# EAGLE design piezo-preamp-tickler_V3-4_single-supply-OPA1642 (EAGLE 8.5.0)

## Sheet 1 of 2
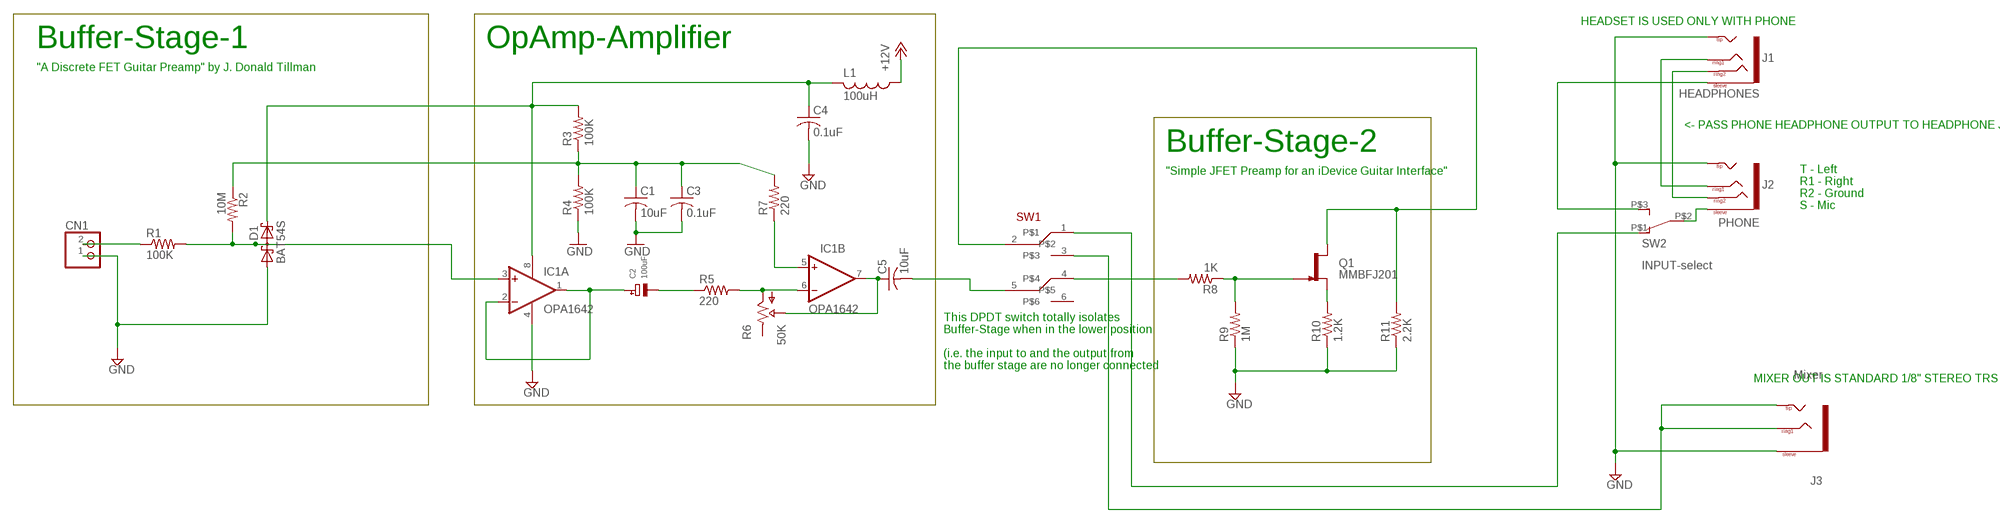
[diagram p0: schematic, sheet 1]

### Parts
C1  10uF  C-USC0805K  [C0805K]
C2  100uF  CAP_TANTALUMA/3216_REFLOW  [EIA3216-18/A-R]
C3  0.1uF  C-USC0805K  [C0805K]
C4  0.1uF  C-USC0805K  [C0805K]
C5  10uF  C-USC0805  [C0805]
CN1  JST_2PIN-THM  [JST-PH-2-THM]
D1  BAT54S  [SOT23]
IC1  OPA1642  OPA2134UA  [SO08]
J1  HEADPHONES  TRRS-1/8"-3.5MMLGPADS  [TRRS_SJ-43514-SMT-TR]
J2  PHONE  TRRS-1/8"-3.5MMLGPADS  [TRRS_SJ-43514-SMT-TR]
J3  Mixer  TRS-1/8"-3.5MM  [TRS_SJ-3524-SMT]
L1  100uH  L-USL3225P  [L3225P]
Q1  MMBFJ201  J201SOT-23  [SOT23-3]
R1  100K  R-US_R0603  [R0603]
R2  10M  R-US_R0603  [R0603]
R3  100K  R-US_R0603  [R0603]
R4  100K  R-US_R0603  [R0603]
R5  220  R-US_R0603  [R0603]
R6  50K  POTPOT-THUMB-ALPHA  [POT-THUMB-14MM_ALPHA-RV100F-30-4K1B-B10K-B301]
R7  220  R-US_R0603  [R0603]
R8  1K  R-US_R0603  [R0603]
R9  1M  R-US_R0603  [R0603]
R10  1.2K  R-US_R0603  [R0603]
R11  2.2K  R-US_R0603  [R0603]
SW1  SWITCH_DPDT  [SWITCH_DPDT_CL-SB-22B]
SW2  INPUT-select  SWITCH_SPDTCL-SB-12B  [SWITCH_SPDT_CL-SB-12B]

### Nets
+12V: L1.1 ; also sheet 2
GND: C1.2 C3.2 C4.2 CN1.1 D1.1(A1) IC1.4(A:V-) J1.TIP J2.TIP J3.1(SLEEVE) R4.1 R9.1 R10.1 R11.1 ; also sheet 2
N$2: CN1.2 R1.1
N$3: Q1.2(S) R10.2
N$4: J1.EARTH(SLEEVE)
N$5: IC1.5(B:+IN) R7.1
N$6: C5.1 IC1.7(B:OUT) R6.P$2(WIPER)
N$7: IC1.6(B:-IN) R5.2 R6.P$1(IN)
N$9: D1.3(C1A2) IC1.3(A:+IN) R1.2 R2.2
N$10: Q1.3(G) R8.1 R9.2
N$11: R8.2 SW1.4
N$12: J3.2(TIP) J3.3(RING1) J3.4(TIP) SW1.3
N$13: J1.RING1 J2.RING1
N$14: C2.- R5.1
N$15: J1.RING2 J2.RING2
N$16: C5.2 SW1.5
N$17: J2.EARTH(SLEEVE) SW2.P$2
N$19: SW1.1 SW2.P$1
N$23: C1.1 C3.1 R2.1 R3.1 R4.2 R7.2
N$24: C2.+ IC1.1(A:OUT) IC1.2(A:-IN)
N$25: C4.1 D1.2(C2) IC1.8(A:V+) L1.2 R3.2
SELECT: Q1.1(D) R11.2 SW1.2
Unconnected: R6.P$3(OUT) SW1.6 SW2.P$3

### Notes on the sheet
- HEADSET IS USED ONLY WITH PHONE
- Buffer-Stage-1 | OpAmp-Amplifier
- "A Discrete FET Guitar Preamp" by J. Donald Tillman
- <- PASS PHONE HEADPHONE OUTPUT TO HEADPHONE JACK
- Buffer-Stage-2
- "Simple JFET Preamp for an iDevice Guitar Interface"
- T - Left
  R1 - Right
  R2 - Ground
  S - Mic
- This DPDT switch totally isolates 
  Buffer-Stage when in the lower position
  
  (i.e. the input to and the output from 
  the buffer stage are no longer connected
- MIXER OUT IS STANDARD 1/8" STEREO TRS

## Sheet 2 of 2
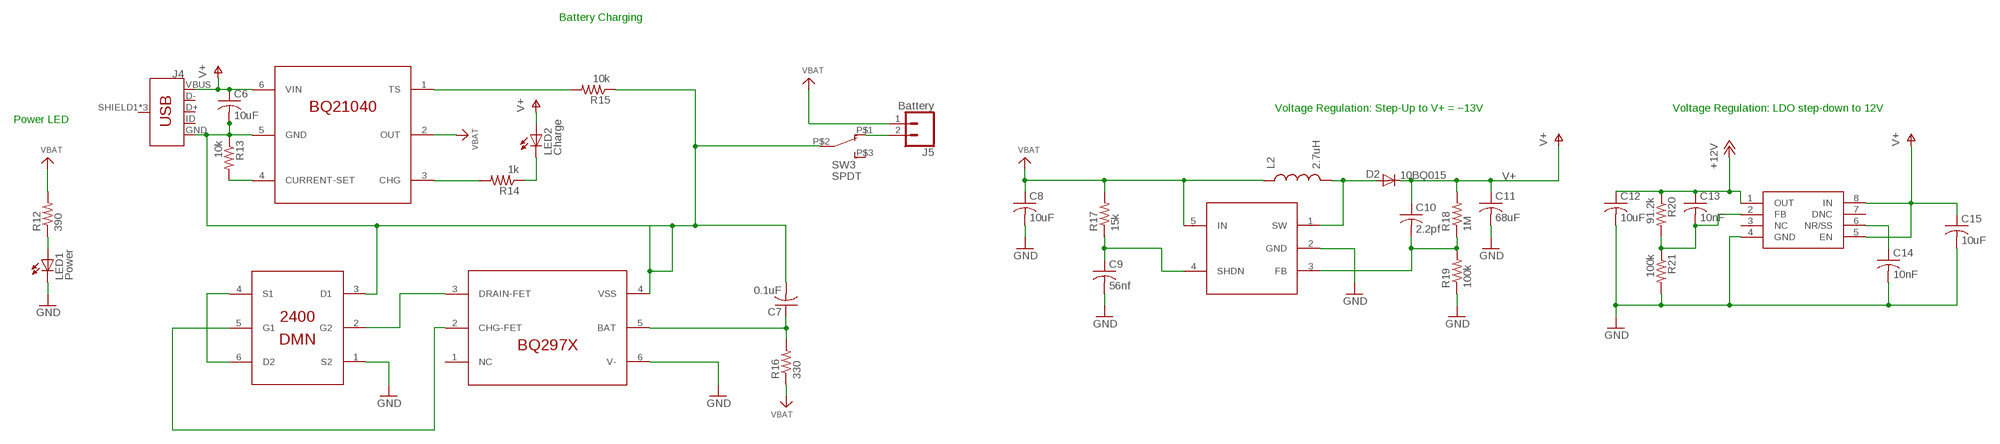
[diagram p1: schematic, sheet 2]

### Parts
C6  10uF  C-USC0805K  [C0805K]
C7  0.1uF  C-USC0805K  [C0805K]
C8  10uF  C-USC0603  [C0603]
C9  56nf  C-USC0603  [C0603]
C10  2.2pf  C-USC0603  [C0603]
C11  68uF  C-USC0603  [C0603]
C12  10uF  C-USC0603  [C0603]
C13  10nF  C-USC0603  [C0603]
C14  10nF  C-USC0603  [C0603]
C15  10uF  C-USC0603  [C0603]
D2  10BQ015  DIODESMA  [SMA-DIODE]
IC2  DMN2400  DUAL-NFET-DMN2400  [SOT-563]
IC3  BQ21040  BQ21040-LIPO-CHARGER  [SOT23-6]
IC4  BQ297X  BQ297X-BATTERY-MANAGER  [WSON-6]
IC5  SC4503  [SOT23-5]
IC6  TPS7A49  [MSOP-8]
J4  USB_MICRO-BREDUCED_PASTE  [USB-B-MICRO-SMD_RED_PASTE]
J5  Battery  CONN_02LOCK  [1X02_LOCK]
L2  2.7uH  INDUCTORCR54  [CR54]
LED1  Power  LED3MM  [LED3MM]
LED2  Charge  LED3MM  [LED3MM]
R12  390  R-US_R0805  [R0805]
R13  10k  R-US_R0805  [R0805]
R14  1k  R-US_R0805  [R0805]
R15  10k  R-US_R0805  [R0805]
R16  330  R-US_R0805  [R0805]
R17  15k  R-US_R0603  [R0603]
R18  1M  R-US_R0603  [R0603]
R19  100k  R-US_R0603  [R0603]
R20  91.2k  R-US_R0603  [R0603]
R21  100k  R-US_R0603  [R0603]
SW3  SPDT  SWITCH_SPDTCL-SB-12B  [SWITCH_SPDT_CL-SB-12B]

### Nets
+12V: C12.1 C13.1 IC6.1(OUT) R20.1 ; also sheet 1
GND: C8.2 C9.2 C11.2 C12.2 C14.2 C15.2 IC2.1(S2) IC4.6(V-) IC5.2(GND) IC6.4(GND) LED1.K(C) R19.1 R21.2 ; also sheet 1
GND2: C6.2 C7.2 IC2.3(D1) IC3.5(GND) IC4.4(VSS) J4.GND R13.1 R15.1 SW3.P$2
N$18: LED1.A R12.1
N$20: J5.2 SW3.P$1
N$22: LED2.K(C) R14.1
N$26: C13.2 IC6.2(FB) R20.2 R21.1
N$27: IC3.3(CHG) R14.2
N$28: C14.1 IC6.6(NR/SS)
N$29: C9.1 IC5.4(SHDN) R17.1
N$30: C10.2 IC5.3(FB) R18.1 R19.2
N$31: IC3.1(TS) R15.2
N$32: D2.A IC5.1(SW) L2.P$2
N$36: IC3.4(CURRENT-SET) R13.2
N$42: C7.1 IC4.5(BAT) R16.2
N$43: IC2.4(S1) IC2.6(D2)
N$44: IC2.5(G1) IC4.2(CHG-FET)
N$45: IC2.2(G2) IC4.3(DRAIN-FET)
V+: C6.1 C10.1 C11.1 C15.1 D2.C IC3.6(VIN) IC6.5(EN) IC6.8(IN) J4.VBUS LED2.A R18.2
VBAT: C8.1 IC3.2(OUT) IC5.5(IN) J5.1 L2.P$1 R12.2 R16.1 R17.2
Unconnected: IC4.1(NC) IC6.3(NC) IC6.7(DNC) J4.D+ J4.D- J4.ID J4.SHIELD1(SHIELD) J4.SHIELD2(SHIELD) J4.SHIELD3(SHIELD) SW3.P$3

### Notes on the sheet
- Battery Charging
- Voltage Regulation: Step-Up to V+ = ~13V | Voltage Regulation: LDO step-down to 12V
- Power LED

## Library data of the parts
C1 C3-C15 = adafruit:C-US: CAPACITOR, American symbol
C2 = microbuilder:CAP_TANTALUM: Tantalum Capacitors Wave footprints have larger pads and are meant to be used for hand soldering. Reflow footprints are optimised for solder paste and a reflow oven. EIA3216-18/A-[R/W] - Size A / 3216-18 / 1206 footprint 4.7µF 25V 10% Tantalum Capacitor 10µF 16V 10% Tantalum Capacitor [Digikey: 495-2236-2-ND] EIA3528-21/B-[R/W] - Size B / 3528-21 47µF 10V 10% Tantalum Capactior [Digikey: 495-2216-1-ND] EIA6032-28/C-[R/W] - Size C / 6032-28 10µF 35V 20% Tantalum Capacitor [Digikey: 495-2285-1-ND] 100µF 16V 10% Tantalum Capactior [Digikey: 399-5214-1-ND]
CN1 = adafruit:JST_2PIN: JST 2-Pin Connectors of various flavors SMT-RA (S2B-PH-SM4) 4UConnector #17311 SMT (B2B-PH-SM4) THM-RA (S2B-PH) THM (B2B-PH)
D1 = diode:BAT54S: Schottky Diodes Pin connection corrected 2011-05-04 Source: Fairchild .. BAT54.pdf
D2 = SparkFun:DIODE: Diode These are standard reverse protection diodes and small signal diodes. SMA package can handle up to about 1A. SOD-323 can handle about 200mA. What the SOD-323 package when ordering, there are some mfgs out there that are 5-pin packages.
IC1 = linear:OPA2*: Dual Operational Amplifier Low Power, Single-Supply, Rail-To-Rail Operational Amplifier Source: http://focus.ti.com/lit/ds/symlink/opa2345.pdf http://focus.ti.com .. opa241.pdf http://focus.ti.com/lit/ds/symlink/opa2134.pdf
IC2 = CMU-ArtFab:DUAL-NFET-DMN2400
IC3 = CMU-ArtFab:BQ21040-LIPO-CHARGER
IC4 = CMU-ArtFab:BQ297X-BATTERY-MANAGER
IC5 = CMU-ArtFab:SC4503
IC6 = CMU-ArtFab:TPS7A49
J1 J2 = CMU-ArtFab:TRRS-1/8"-3.5MM: Audio jack - 3.5mm TRRS variety - two rings.
J3 = CMU-ArtFab:TRS-1/8"-3.5MM
J4 = SparkFun-Connectors:USB_MICRO-B: USB Type Micro-B Connector Male/female and PTH/SMT variants SparkFun Products: SparkFun microB USB Breakout <https://www.sparkfun.com/products/12035> SparkFun USB microB Plug Breakout <https://www.sparkfun.com/products/10031> SparkFun ESP8266 Thing <https://www.sparkfun.com/products/13231>; PROD_ID: CONN-11752
J5 = SparkFun-Connectors:CONN_02: Multi connection point. Often used as Generic Header-pin footprint for 0.1 inch spaced/style header connections On any of the 0.1 inch spaced packages, you can populate with these: Break Away Headers - Straight <https://www.sparkfun.com/products/116> (PRT-00116) Break Away Male Headers - Right Angle <https://www.sparkfun.com/products/553> (PRT-00553) Female Headers <https://www.sparkfun.com/products/115> (PRT-00115) Break Away Headers - Machine Pin <https://www.sparkfun.com/products/117> (PRT-00117) Break Away Female Headers - Swiss Machine Pin <https://www.sparkfun.com/products/743> (PRT-00743) For SCREWTERMINALS and SPRING TERMINALS visit here: Screw Terimnals on SparkFun.com <https://www.sparkfun.com/search/results?term=Screw+Terminals> (5mm/3.5mm/2.54mm spacing) This device is also useful as a general connection point to wire up your design to another part of your project. Our various solder wires solder well into these plated through hole pads. Hook-Up Wire - Assortment (Stranded, 22 AWG) <https://www.sparkfun.com/products/11375> (PRT-11375) Hook-Up Wire - Assortment (Solid Core, 22 AWG) <https://www.sparkfun.com/products/11367> (PRT-11367) View the entire wire category on our website here <https://www.sparkfun.com/categories/141> Special notes: Molex polarized connector foot print use with: PRT-08233 with associated crimp pins and housings. 2.54_SCREWTERM for use with PRT-10571. 3.5mm Screw Terminal footprints for PRT-08084 5mm Screw Terminal footprints for use with PRT-08432
L1 = rcl:L-US: INDUCTOR, American symbol; SPICEPREFIX: L
L2 = SparkFun-Passives:INDUCTOR: Inductors Basic Inductor/Choke - 0603 and 1206. Footprints are not proven and vary greatly between part numbers. SRN6045- 33uH, 20% 1.4A SDR0403-560KL - 56uH, 10%, 500mA RMS/740mA peak
LED1 LED2 = led:LED: LED OSRAM: - CHIPLED LG R971, LG N971, LY N971, LG Q971, LY Q971, LO R971, LY R971 LH N974, LH R974 LS Q976, LO Q976, LY Q976 LO Q996 - Hyper CHIPLED LW Q18S LB Q993, LB Q99A, LB R99A - SideLED LS A670, LO A670, LY A670, LG A670, LP A670 LB A673, LV A673, LT A673, LW A673 LH A674 LY A675 LS A676, LA A676, LO A676, LY A676, LW A676 LS A679, LY A679, LG A679 - Hyper Micro SIDELED® LS Y876, LA Y876, LO Y876, LY Y876 LT Y87S - SmartLED LW L88C, LW L88S LB L89C, LB L89S, LG L890 LS L89K, LO L89K, LY L89K LS L896, LA L896, LO L896, LY L896 - TOPLED LS T670, LO T670, LY T670, LG T670, LP T670 LSG T670, LSP T670, LSY T670, LOP T670, LYG T670 LG T671, LOG T671, LSG T671 LB T673, LV T673, LT T673, LW T673 LH T674 LS T676, LA T676, LO T676, LY T676, LB T676, LH T676, LSB T676, LW T676 LB T67C, LV T67C, LT T67C, LS T67K, LO T67K, LY T67K, LW E67C LS E67B, LA E67B, LO E67B, LY E67B, LB E67C, LV E67C, LT E67C LW T67C LS T679, LY T679, LG T679 LS T770, LO T770, LY T770, LG T770, LP T770 LB T773, LV T773, LT T773, LW T773 LH T774 LS E675, LA E675, LY E675, LS T675 LS T776, LA T776, LO T776, LY T776, LB T776 LHGB T686 LT T68C, LB T68C - Hyper Mini TOPLED® LB M676 - Mini TOPLED Santana® LG M470 LS M47K, LO M47K, LY M47K Source: http://www.osram.convergy.de LUXEON: - LUMILED® LXK2-PW12-R00, LXK2-PW12-S00, LXK2-PW14-U00, LXK2-PW14-V00 LXK2-PM12-R00, LXK2-PM12-S00, LXK2-PM14-U00 LXK2-PE12-Q00, LXK2-PE12-R00, LXK2-PE12-S00, LXK2-PE14-T00, LXK2-PE14-U00 LXK2-PB12-K00, LXK2-PB12-L00, LXK2-PB12-M00, LXK2-PB14-N00, LXK2-PB14-P00, LXK2-PB14-Q00 LXK2-PR12-L00, LXK2-PR12-M00, LXK2-PR14-Q00, LXK2-PR14-R00 LXK2-PD12-Q00, LXK2-PD12-R00, LXK2-PD12-S00 LXK2-PH12-R00, LXK2-PH12-S00 LXK2-PL12-P00, LXK2-PL12-Q00, LXK2-PL12-R00 Source: www.luxeon.com KINGBRIGHT: KA-3528ASYC Source: www.kingbright.com
Q1 = CMU-ArtFab:J201: N-channel JFET
R1-R5 R7-R21 = CMU-ArtFab:R-US_: RESISTOR, American symbol
R6 = CMU-ArtFab:POT: http://www.taydaelectronics.com/10k-ohm-linear-taper-potentiometer-round-shaft-pcb-9mm.html http://www.taydaelectronics.com/datasheets/A-1847.pdf
SW1 = CMU-ArtFab:SWITCH_DPDT
SW2 SW3 = CMU-ArtFab:SWITCH_SPDT

## Board
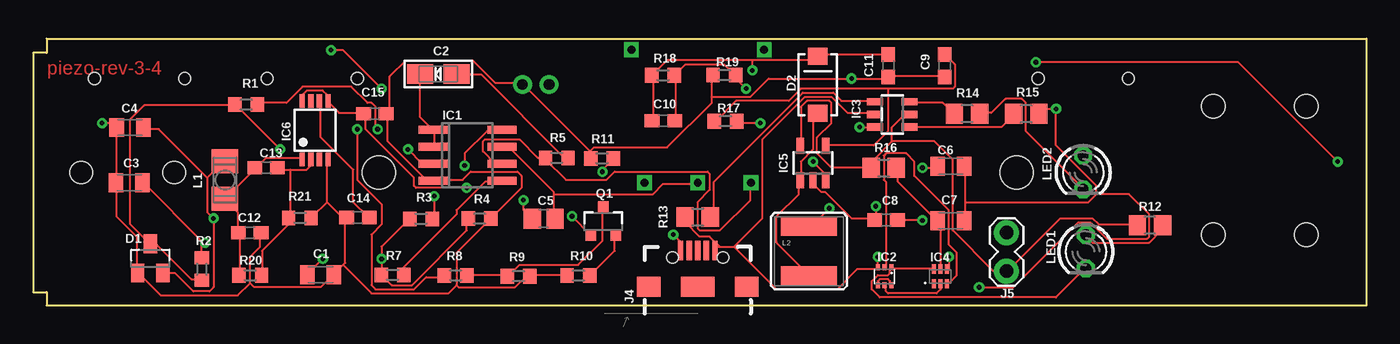
[diagram p2: board, top side]
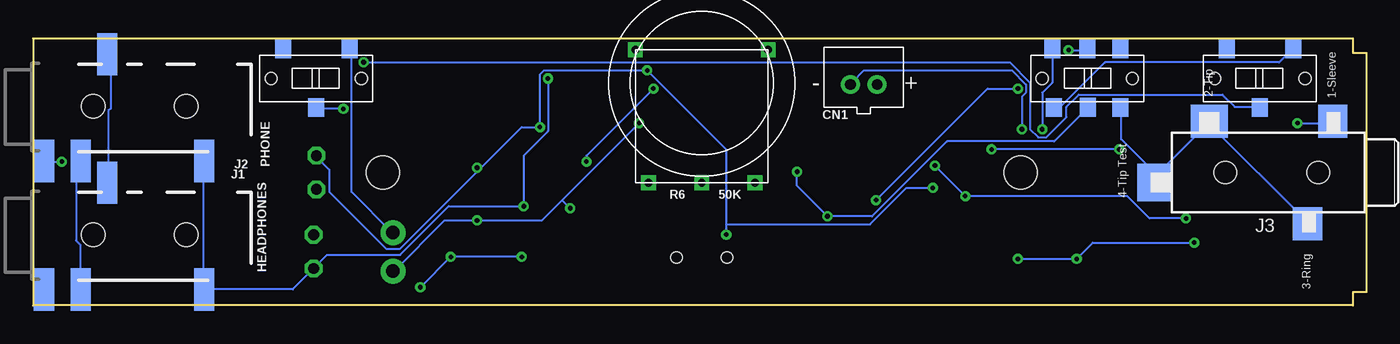
[diagram p3: board, bottom side, seen from below]

Size 100.3 x 20.07 mm. Coordinates in mm from the lower left corner, seen from the top.
Outline: 0,19 0,1 1.02,1 1.02,0 100.3,0 100.3,20.07 1,20.07 1,19 0,19
Copper layers (1*16): Top 0.035mm / dielectric 1.5mm / Bottom 0.035mm
Design rules "default *": minimum track width 6mil, minimum drill 0.35mm, track to track 6mil, track to pad 6mil, pad to pad 6mil, via to via 6mil, smd to smd 6mil, copper to edge 8mil, drill to drill 6mil, minimum pad ring 10mil, minimum via ring 8mil, stop-mask expansion 4mil, vias tented up to drill 20mil, thermal gap 10mil
Holes 2.5 mm at 74,10 26,10

### Footprints (pad centres in the part's own frame; a part is rotated, then mirrored left to right if it is on the bottom)
C0805K = smd 1.1 x 1.4: 1 -1,0; 2 1,0
EIA3216-18/A-R = smd 1.95 x 1.5: + 1.375,0; - -1.375,0
C0805 = smd 1.3 x 1.5: 1 -0.85,0; 2 0.85,0
C0603 = smd 1.1 x 1: 1 -0.85,0; 2 0.85,0
JST-PH-2-THM = drill 0.8 pad 1.422: 1 1,0; 2 -1,0
SOT23 = smd 1 x 1.4: 1 -0.95,-1.1; 2 0.95,-1.1; 3 0,1.1
SMA-DIODE = smd 1.27 x 1.47: A -2.15,0; C 2.15,0
SO08 = smd 0.6 x 2.2: 1 -1.905,-2.6; 2 -0.635,-2.6; 3 0.635,-2.6; 4 1.905,-2.6; 5 1.905,2.6; 6 0.635,2.6; 7 -0.635,2.6; 8 -1.905,2.6
SOT-563 = smd 0.3 x 0.45: 1 -0.5,-0.675; 2 0,-0.675; 3 0.5,-0.675; 4 0.5,0.675; 5 0,0.675; 6 -0.5,0.675
SOT23-6 = smd 0.55 x 1.2: 1 -0.95,-1.3; 2 0,-1.3; 3 0.95,-1.3; 4 0.95,1.3; 5 0,1.3; 6 -0.95,1.3
WSON-6 = smd 0.3 x 0.7: 1 -0.5,-0.55; 2 0,-0.55; 3 0.5,-0.55; 4 0.5,0.55; 5 0,0.55; 6 -0.5,0.55
SOT23-5 = smd 0.55 x 1.2: 1 -0.95,-1.3; 2 0,-1.3; 3 0.95,-1.3; 4 0.95,1.3; 5 -0.95,1.3
MSOP-8 = smd 0.4 x 1: 1 -0.975,-2.2; 2 -0.325,-2.2; 3 0.325,-2.2; 4 0.975,-2.2; 5 0.975,2.2; 6 0.325,2.2; 7 -0.325,2.2; 8 -0.975,2.2
TRRS_SJ-43514-SMT-TR = smd 1.524 x 3.175: EARTH -7.067,-4.128; RING1 -2.309,3.901; RING2 -4.293,-4.128; TIP 4.995,-4.128 | hole 1.778: -3.353,-0.007; 3.647,-0.007
TRS_SJ-3524-SMT = smd 2.5 x 2.2: 1 3.85,-4.6; 3 -3.85,-2.7 | smd 2.5 x 2.8: 2 3.85,4.7 | smd 2.8 x 2.5: 4 -0.75,8.85 | hole 1.7: 0,-3.5; 0,3.5
USB-B-MICRO-SMD_RED_PASTE = smd 1.45 x 0.4: D+ 2.725,0; D- 2.725,0.65; GND 2.725,-1.3; ID 2.725,-0.65; VBUS 2.725,1.3 | smd 1.5 x 1.8: SHIELD1 0,3.685; SHIELD2 0,-3.685 | smd 1.5 x 2.5: SHIELD3 0,0 | hole 0.85: 2.2,1.9; 2.2,-1.9
1X02_LOCK = drill 1.016 pad 1.88: 1 -0.178,0; 2 2.718,0
L3225P = smd 1.8 x 2: 1 -1.4,0; 2 1.4,0
CR54 = smd 4.2 x 1.4: P$1 0,1.85; P$2 0,-1.85
LED3MM = drill 0.813 octagon: A -1.27,0; K 1.27,0
SOT23-3 = smd 0.8 x 0.9: 1 -0.95,-1; 2 0.95,-1; 3 0,1.1
R0603 = smd 1 x 1.1: 1 -0.85,0; 2 0.85,0
POT-THUMB-14MM_ALPHA-RV100F-30-4K1B-B10K-B301 = drill 0.6 square: P$1 -4,-7.5; P$2 0,-7.5; P$3 4,-7.5; P$4 -5,2.5; P$5 5,2.5
R0805 = smd 1.3 x 1.5: 1 -0.95,0; 2 0.95,0
SWITCH_DPDT_CL-SB-22B = smd 1.2 x 1.4: 1 -2.5,-2.2; 2 0.05,-2.17; 3 2.5,-2.2; 4 -2.63,2.2; 5 0,2.2; 6 2.51,2.2 | hole 0.9: -3.4,0; 3.4,0
SWITCH_SPDT_CL-SB-12B = smd 1.2 x 1.4: P$1 -2.5,-2.2; P$2 0,2.2; P$3 2.5,-2.2 | hole 0.9: -3.4,0; 3.4,0

### Placement (x,y rotation side)
C1  21.62,2.31 0 top
C2  30.48,17.41 180 top
C3  7.23,9.23 180 top
C4  7.29,13.38 180 top
C5  38.41,6.53 180 top
C6  69.04,10.47 0 top
C7  69.04,6.37 0 top
C8  64.17,6.43 180 top
C9  68.58,18.03 270 top
C10  47.41,13.89 0 top
C11  64.33,18.03 270 top
C12  16.3,5.47 0 top
C13  17.54,10.35 0 top
C14  24.43,6.61 180 top
C15  25.71,14.42 0 top
CN1  37.81,16.62 0 bottom
D1  8.81,3.54 0 top
D2  59.04,16.61 90 top
IC1  32.68,11.3 270 top
IC2  64.06,2.19 180 top
IC3  64.64,14.37 90 top
IC4  68.25,2.19 0 top
IC5  58.67,10.72 0 top
IC6  21.21,13.18 0 top
J1  92.43,5.33 0 bottom
J2  92.43,14.99 0 bottom
J3  7.11,10 90 bottom
J4  50,1.41 90 top
J5  73.23,2.75 90 top
L1  14.44,9.44 90 top
L2  58.37,4.09 0 top
LED1  79.2,4.05 270 top
LED2  79,10 270 top
Q1  42.9,6.3 0 top
R1  16.03,15.11 180 top
R2  12.68,2.74 270 top
R3  29.18,6.51 0 top
R4  33.58,6.54 180 top
R5  39.39,11.1 180 top
R6  50,16.73 0 bottom
R7  27.04,2.31 180 top
R8  31.78,2.26 180 top
R9  36.52,2.2 180 top
R10  41.02,2.24 0 top
R11  42.79,11.07 0 top
R12  84.02,6.03 180 top
R13  49.99,6.66 0 top
R14  70.26,14.42 180 top
R15  74.72,14.41 180 top
R16  63.99,10.34 0 top
R17  52.09,13.86 0 top
R18  47.39,17.31 180 top
R19  52,17.33 0 top
R20  16.34,2.27 0 top
R21  20.07,6.59 0 top
SW1  21,17.08 0 bottom
SW2  8,17.08 180 bottom
SW3  79,17.08 180 bottom

### Tracks (layer width: path | path; a pad name or v marks a point on that pad's centre or on a via)
+12V
  Top 0.152: IC6.1 20.12,11.12 17.53,11.12 16.76,10.36 C13.1 16.61,10.21 14.48,8.08 L1.1 14.48,7.92 15.39,7.01 15.39,5.49 C12.1 15.54,5.33 15.54,2.29 R20.1
GND  (via drill 0.35)
  Top 0.152: IC5.2 58.52,9.3 59.28,8.53 59.59,8.53 61.57,6.55 63.25,6.55 C8.2 63.4,6.55 v63.4,7.47 | IC4.6 67.67,2.74 64.62,2.74 IC2.1 64.47,2.74 64.47,2.44 64.31,2.29 63.55,2.29 63.09,1.83 63.09,1.22 63.7,0.61 76.96,0.61 79.1,2.74 LED1.K | C9.2 68.58,17.22 64.47,17.22 C11.2 64.31,17.07 v61.57,17.07 55.32,17.07 53.95,15.7 51.05,15.7 | 41.91,11.58 41.91,11.12 R11.1 41.91,11.58 | 41.91,11.58 36.88,16.61 CN1.1 36.73,16.76 34.75,16.76 33.07,18.44 28.04,18.44 26.82,17.22 26.82,14.63 26.67,14.48 C15.2 26.67,14.33 26.67,12.34 29.57,9.45 30.02,9.45 IC1.4 30.18,9.45 32.31,9.45 32.92,10.06 36.42,10.06 36.73,9.75 36.73,8.84 34.44,6.55 R4.1 34.29,6.4 31.85,3.96 31.85,1.52 | 51.05,15.7 51.05,15.24 47.7,11.89 42.22,11.89 41.91,11.58 | 51.05,15.7 51.05,17.22 R19.1 | R10.1 40.08,2.29 37.49,2.29 R9.1 37.34,2.13 37.03,2.13 36.27,1.37 32,1.37 31.85,1.52 | 22.1,7.77 22.1,10.97 IC6.4 | 22.1,7.77 21.03,6.71 R21.2 | 22.1,7.77 23.16,6.71 23.47,6.71 C14.2 23.47,6.55 23.47,3.2 23.32,3.05 | 16.31,1.68 16.31,3.66 17.07,4.42 17.07,5.33 C12.2 | 16.31,1.68 16.61,1.37 21.64,1.37 22.55,2.29 C1.2 22.71,2.44 23.32,3.05 | v5.18,13.72 5.94,13.72 6.25,13.41 C4.2 6.25,13.26 6.25,9.3 C3.2 6.25,9.14 6.25,6.71 7.77,5.18 7.77,2.59 D1.1 7.92,2.44 9.6,0.76 15.39,0.76 16.31,1.68 | 31.85,1.52 31.24,0.91 25.45,0.91 23.32,3.05
  Bottom 0.152: J2.TIP 87.48,10.82 87.48,1.22 J1.TIP 87.33,1.22 80.77,1.22 79.25,2.74 LED1.K 79.1,2.9 78.18,3.81 72.69,3.81 69.04,7.47 v63.4,7.47 63.4,11.28 61.57,13.11 v61.57,17.07 | v5.18,13.72 2.59,13.72 J3.1
GND2  (via drill 0.35)
  Top 0.152: R15.1 75.74,14.48 76.05,14.78 v76.96,14.78 76.96,12.04 80.01,8.99 80.01,8.38 | 70.1,7.77 70.1,10.36 C6.2 | 70.1,7.77 70.1,6.4 C7.2 | 80.01,8.38 79.4,7.77 70.1,7.77 | 52.73,4.42 55.93,1.22 60.5,1.22 62.03,2.74 63.55,2.74 IC2.3 63.55,2.9 v63.55,3.66 | 51.66,4.42 51.51,4.42 51.36,4.27 J4.GND | 51.66,4.42 52.73,4.42 | v68.89,3.66 68.89,2.74 IC4.4 | 52.73,4.42 54.86,6.55 54.86,12.5 58.06,15.7 60.05,15.7 61.27,14.48 63.25,14.48 IC3.5 | 51.66,4.42 50.9,5.18 50.14,5.18 49.07,6.25 49.07,6.55 R13.1 | 80.01,8.38 82.45,8.38 83.97,6.86 83.97,5.18 83.82,5.03 80.77,5.03 79.55,6.25 78.64,6.25 73.76,1.37 v71.17,1.37
  Bottom 0.152: v76.96,14.78 78.94,14.78 SW3.P$2 | v63.55,3.66 v68.89,3.66 v71.17,1.37
N$2  (via drill 0.35)
  Top 0.152: v25.91,13.26 25.76,13.41 25.76,14.94 25.45,15.24 25.15,15.24 23.93,16.46 20.27,16.46 19.05,15.24 16.92,15.24 R1.1
  Bottom 0.152: v25.91,13.26 25.91,15.7 25.6,16 25.6,16.61 26.67,17.68 37.8,17.68 38.71,16.76 CN1.2
N$3
  Top 0.152: Q1.2 43.74,5.18 43.74,4.12 41.91,2.29 R10.2
N$5
  Top 0.152: R7.1 27.89,2.44 27.89,2.9 31.85,6.86 31.85,7.16 33.98,9.3 35.2,9.3 IC1.5
N$6
  Top 0.152: 39.17,8.38 39.17,8.53 35.81,11.89 35.36,11.89 IC1.7 | 39.17,8.38 39.17,6.55 C5.1 | 39.17,8.38 46.63,8.38 47.4,9.14 49.99,9.14 R6.P$2
N$7
  Top 0.152: IC1.6 35.2,10.67 34.75,10.67 33.83,11.58 33.83,12.34 33.98,12.5 36.58,12.5 37.95,11.12 38.41,11.12 R5.2 38.56,10.97 40.08,9.45 43.13,9.45 43.74,10.06 50.75,10.06 50.9,9.91 50.9,8.69 49.99,7.77 49.99,5.79 50.14,5.64 51.66,5.64 53.95,7.92 53.95,9.14 R6.P$1
N$9  (via drill 0.35)
  Top 0.152: R2.2 12.65,1.98 11.89,1.98 9.3,4.57 8.84,4.57 D1.3 8.69,4.72 7.32,6.1 7.32,14.02 8.38,15.09 15.09,15.09 R1.2 15.24,15.09 v18.59,11.73 | v28.19,11.73 29.26,10.67 30.02,10.67 IC1.3
  Bottom 0.152: v18.59,11.73 v28.19,11.73
N$10
  Top 0.152: Q1.3 42.82,7.32 42.82,4.88 41,3.05 36.58,3.05 35.81,2.29 R9.2 35.66,2.29 32.77,2.29 R8.1
N$11  (via drill 0.35)
  Top 0.152: v24.38,13.26 24.38,9.45 26.21,7.62 26.21,6.1 25.45,5.33 25.45,1.52 25.76,1.22 28.65,1.22 29.57,2.13 30.79,2.13 R8.2
  Bottom 0.152: v24.38,13.26 24.38,16 23.62,16.76 23.62,19.2 SW1.4
N$12
  Bottom 0.152: 16,10.06 18.44,12.5 18.44,14.78 SW1.3 | 16,10.06 16,9.3 J3.4 16,10.06 | 11.89,13.72 4.42,6.25 J3.3 | 16,10.06 15.54,10.06 11.89,13.72 | 11.89,13.72 J3.2
N$13
  Bottom 0.152: J1.RING1 94.64,9.3 94.64,14.63 94.49,14.78 94.49,18.59 94.64,18.75 J2.RING1
N$14
  Top 0.152: R5.1 40.23,11.12 39.93,11.12 33.68,17.37 32,17.37 C2.-
N$15
  Bottom 0.152: J1.RING2 96.77,1.22 96.77,4.57 97.08,4.88 97.08,10.52 96.77,10.82 J2.RING2
N$16  (via drill 0.35)
  Top 0.152: v22.4,19.2 23.32,19.2 v26.21,16.31 | v36.88,7.92 36.88,7.16 37.49,6.55 C5.2
  Bottom 0.152: v22.4,19.2 21.03,19.2 SW1.5 | v26.21,16.31 28.5,16.31 v36.88,7.92
N$17  (via drill 0.35)
  Top 0.152: v75.44,18.29 90.68,18.29 v98.15,10.82
  Bottom 0.152: v75.44,18.29 26.82,18.29 25.3,16.76 25.3,13.26 24.69,12.65 24.08,12.65 22.55,14.17 22.55,14.94 21.64,15.85 10.82,15.85 9.91,14.94 8.08,14.94 SW2.P$2 | v98.15,10.82 99.36,10.82 J2.EARTH
N$18
  Top 0.152: R12.1 84.89,5.94 84.89,5.64 83.97,4.72 79.7,4.72 79.25,5.18 LED1.A
N$19
  Bottom 0.152: SW1.1 23.47,14.94 23.01,14.94 19.66,18.29 6.55,18.29 5.64,19.2 SW2.P$1
N$20
  Bottom 0.152: SW3.P$1 76.35,19.2 76.35,8.53 73.3,5.49 J5.2
N$22
  Top 0.152: R14.1 71.32,14.48 72.08,14.48 73.15,15.54 74.37,15.54 74.68,15.24 74.68,13.11 78.94,8.84 LED2.K
N$23  (via drill 0.35)
  Top 0.152: 12.65,4.72 12.65,4.88 8.38,9.14 C3.1 | 12.65,4.72 12.65,3.66 R2.1 | R3.1 28.19,6.4 26.21,4.42 v26.21,3.5 26.21,2.44 R7.2 26.21,2.29 26.98,1.52 28.5,1.52 32.61,5.64 32.61,6.4 R4.2 | v21.79,3.5 20.73,2.44 C1.1 | v12.95,4.72 12.65,4.72
  Bottom 0.152: v26.21,3.5 v21.79,3.5 20.57,4.72 v12.95,4.72
N$24
  Top 0.152: C2.+ 29.11,17.37 29.11,14.17 30.02,13.26 IC1.1 30.18,13.11 30.18,12.04 IC1.2
N$25  (via drill 0.35)
  Top 0.152: v30.18,8.23 30.18,6.55 R3.2 | v32.46,10.52 32.46,11.43 34.14,13.11 35.2,13.11 IC1.8 | 13.11,9.6 13.11,7.01 v13.56,6.55 13.56,1.37 13.26,1.07 12.04,1.07 10.67,2.44 9.91,2.44 D1.2 | 13.11,9.6 14.33,10.82 L1.2 | 13.11,9.6 9.45,13.26 8.38,13.26 C4.1
  Bottom 0.152: v32.46,10.52 v30.18,8.23 17.98,8.23 16.31,6.55 v13.56,6.55
N$26
  Top 0.152: 19.36,10.21 18.44,10.21 C13.2 | 19.36,10.21 20.57,10.21 20.88,10.52 IC6.2 | R20.2 17.22,2.29 17.22,4.12 19.2,6.1 19.2,6.55 R21.1 19.36,6.71 19.36,10.21
N$27
  Top 0.152: IC3.3 65.99,15.24 68.43,15.24 69.19,14.48 R14.2
N$28
  Top 0.152: IC6.6 21.64,15.24 21.64,12.65 24.08,10.21 24.08,7.77 25.15,6.71 C14.1
N$29
  Top 0.152: 64.31,16.31 69.19,16.31 69.34,16.46 69.34,18.14 68.73,18.75 C9.1 | 64.31,16.31 57.76,16.31 56.84,15.39 52.88,15.39 51.36,13.87 R17.1 | 64.31,16.31 64.31,13.11 63.25,12.04 59.74,12.04 IC5.4
N$30  (via drill 0.35)
  Top 0.152: C10.2 48.31,14.02 48.31,17.22 R18.1 48.31,17.37 49.07,18.14 51.97,18.14 52.73,17.37 R19.2 52.73,17.22 v53.65,16.31 | v58.67,10.82 59.59,9.91 59.59,9.45 IC5.3
  Bottom 0.152: v58.67,10.82 58.67,11.28 v53.65,16.31
N$31
  Top 0.152: IC3.1 65.99,13.41 72.85,13.41 73.76,14.33 R15.2
N$32
  Top 0.152: D2.A 58.98,14.33 58.67,14.02 58.67,11.73 57.76,10.82 57.76,9.45 IC5.1 57.61,9.3 57.61,8.38 55.93,6.71 55.93,4.72 58.37,2.29 L2.P$2
N$36
  Top 0.152: IC3.4 63.25,15.39 60.81,15.39 60.2,16 57.91,16 51.21,9.3 51.21,6.86 51.05,6.71 R13.2
N$42
  Top 0.152: IC4.5 68.28,2.74 68.28,6.1 68.12,6.25 C7.1 67.97,6.4 65.08,9.3 65.08,10.21 R16.2
N$43
  Top 0.152: IC2.4 63.55,1.52 63.55,1.83 63.7,1.98 64.31,1.98 64.47,1.83 64.47,1.52 IC2.6
N$44
  Top 0.152: IC2.5 64.16,1.37 64.16,1.07 64.31,0.91 67.97,0.91 68.28,1.22 68.28,1.52 IC4.2
N$45
  Top 0.152: IC2.2 64.16,2.9 64.16,9.3 64.01,9.45 64.01,11.28 64.16,11.43 65.68,11.43 66.29,10.82 66.29,9.75 68.89,7.16 68.89,4.57 69.49,3.96 69.49,2.29 68.89,1.68 IC4.3
SELECT  (via drill 0.35)
  Top 0.152: v40.54,6.71 Q1.1 | v42.82,10.06 42.82,10.21 43.59,10.97 R11.2
  Bottom 0.152: SW1.2 21.03,14.78 23.47,12.34 31.55,12.34 37.19,6.71 v40.54,6.71 42.82,8.99 v42.82,10.06
V+  (via drill 0.35)
  Top 0.152: C10.1 46.63,14.02 46.63,17.22 R18.2 46.63,17.37 47.7,18.44 54.1,18.44 | C11.1 64.31,18.9 59.13,18.9 D2.C 58.98,18.75 58.67,18.44 54.1,18.44 | IC6.8 20.27,15.39 20.27,15.85 20.57,16.15 21.79,16.15 22.1,15.85 22.1,15.39 IC6.5 22.25,15.24 23.01,14.48 24.84,14.48 C15.1 24.99,14.33 24.99,13.26 28.65,9.6 28.65,8.99 28.8,8.84 v32.61,8.84 | v62.18,13.41 63.25,13.41 IC3.6 | v66.9,10.36 67.97,10.36 C6.1 | v48.16,5.33 48.62,4.88 48.62,4.27 J4.VBUS | v54.1,17.68 54.1,18.44
  Bottom 0.152: 66.75,10.21 72.69,4.27 73.76,4.27 78.03,8.53 78.03,10.21 78.94,11.12 LED2.A | 66.75,10.21 63.55,13.41 v62.18,13.41 62.18,17.37 61.87,17.68 v54.1,17.68 48.16,11.73 48.16,6.1 | 66.75,10.21 v66.9,10.36 | 48.16,6.1 v48.16,5.33 | v32.61,8.84 34.59,8.84 37.34,6.1 48.16,6.1
VBAT  (via drill 0.35)
  Top 0.152: IC5.5 57.76,12.04 57.76,14.94 58.22,15.39 59.89,15.39 60.05,15.24 60.05,13.72 58.98,12.65 58.98,11.43 60.05,10.36 62.94,10.36 R16.1 63.09,10.36 63.09,10.82 64.62,12.34 | 64.62,12.34 64.62,13.41 65.53,14.33 65.84,14.33 IC3.2 | v66.9,6.4 65.08,6.4 C8.1 | v54.71,13.72 53.03,13.72 R17.2 | R12.2 83.06,6.1 80.16,6.1 79.7,6.55 77.27,6.55 73.3,2.59 J5.1 73.15,2.59 72.24,2.59 69.19,5.64 69.19,10.97 67.82,12.34 64.62,12.34 | v59.89,7.32 58.52,5.94 L2.P$1
  Bottom 0.152: J5.1 73.15,2.59 69.34,6.4 v66.9,6.4 62.03,6.4 60.5,7.92 | 60.5,7.92 v54.71,13.72 | 60.5,7.92 v59.89,7.32

### Text on the board
Top: piezo-rev-3-4